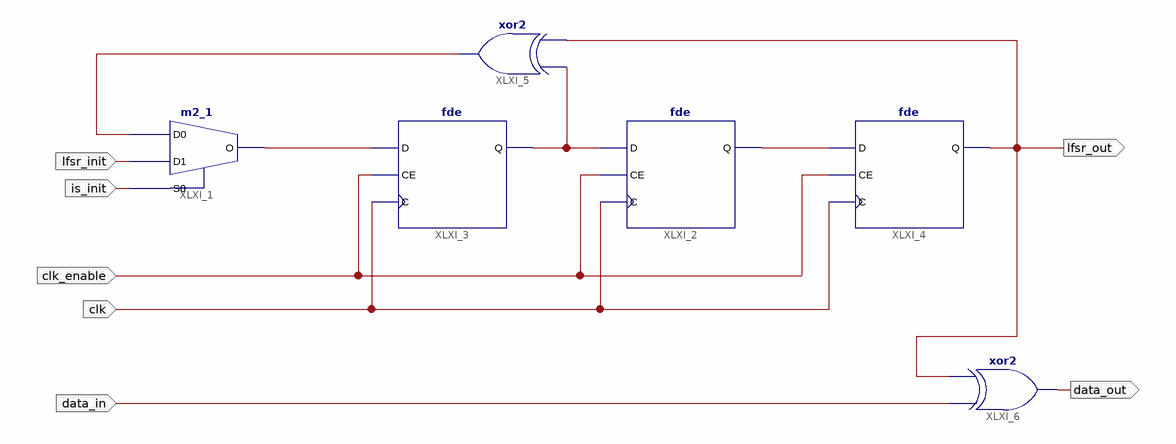
[diagram p0: schematic sheet 1]
// Xilinx ISE schematic LFSR.sch (spartan3) as structural Verilog: 6 symbols, 7 ports
module LFSR (
  input  lfsr_init,
  input  is_init,
  input  clk,
  input  clk_enable,
  input  data_in,
  output lfsr_out,
  output data_out
);

  wire XLXN_11, XLXN_12, XLXN_14, XLXN_15;

  m2_1 XLXI_1 (.D0(XLXN_11), .D1(lfsr_init), .S0(is_init), .O(XLXN_12));
  fde XLXI_2 (.C(clk), .CE(clk_enable), .D(XLXN_14), .Q(XLXN_15));
  fde XLXI_3 (.C(clk), .CE(clk_enable), .D(XLXN_12), .Q(XLXN_14));
  fde XLXI_4 (.C(clk), .CE(clk_enable), .D(XLXN_15), .Q(lfsr_out));
  xor XLXI_5 (XLXN_11, lfsr_out, XLXN_14);
  xor XLXI_6 (data_out, data_in, lfsr_out);
endmodule
